# Altium schematic sheet USB.SchDoc
size A4
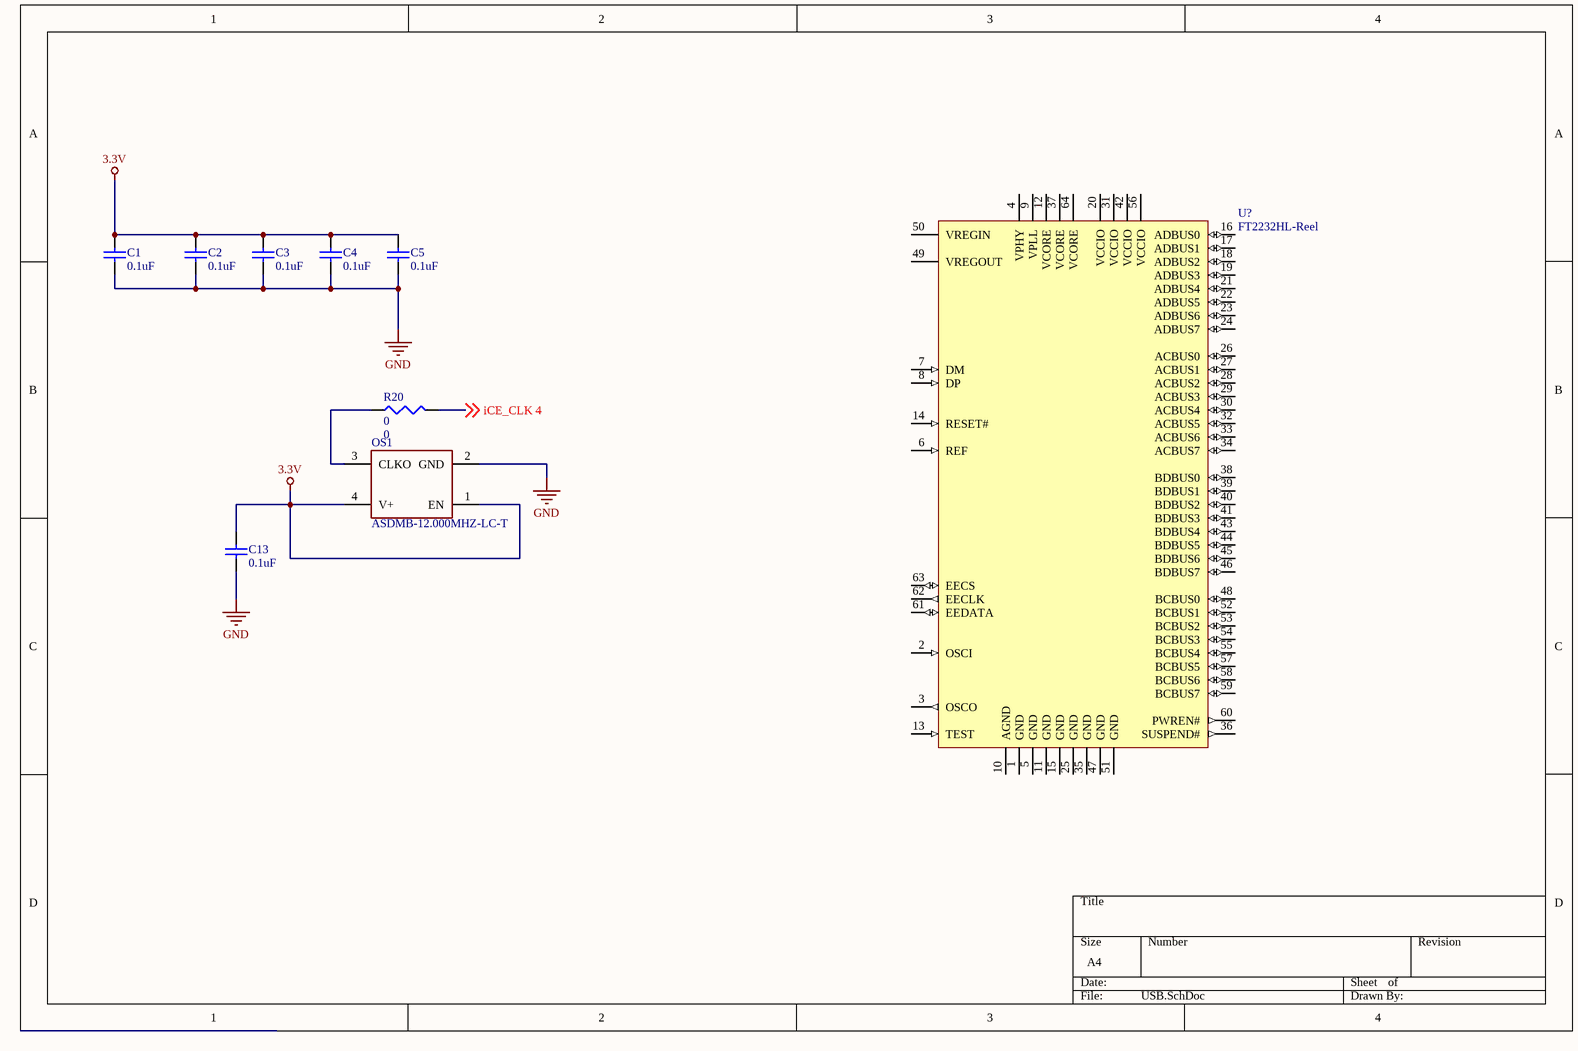
[diagram p0: USB.SchDoc]

## Parts
C1  0.1uF  [1608[0603]]
C2  0.1uF  [1608[0603]]
C3  0.1uF  [1608[0603]]
C4  0.1uF  [1608[0603]]
C5  0.1uF  [1608[0603]]
C13  0.1uF  [1608[0603]]
OS1  ASDMB-12.000MHZ-LC-T  [Q2520]
R20  0  [J1-0603]
U?  FT2232HL-Reel  [LQFP-64_N]

## Nets
3.3V: C1.2 C2.2 C3.2 C4.2 C5.2 C13.2 OS1.1(EN) OS1.4(V+)
GND: C1.1 C2.1 C3.1 C4.1 C5.1 C13.1 OS1.2(GND)
iCE_CLK 4: R20.2 ; off-sheet iCE_CLK 4
NetOS1_3: OS1.3(CLKO) R20.1

Not connected (* = marked no-connect by the designer): U? 1(GND) 2(OSCI) 3(OSCO) 4(VPHY) 5(GND) 6(REF) 7(DM) 8(DP) 9(VPLL) 10(AGND) 11(GND) 12(VCORE) 13(TEST) 14(RESET#) 15(GND) 16(ADBUS0) 17(ADBUS1) 18(ADBUS2) 19(ADBUS3) 20(VCCIO) 21(ADBUS4) 22(ADBUS5) 23(ADBUS6) 24(ADBUS7) 25(GND) 26(ACBUS0) 27(ACBUS1) 28(ACBUS2) 29(ACBUS3) 30(ACBUS4) 31(VCCIO) 32(ACBUS5) 33(ACBUS6) 34(ACBUS7) 35(GND) 36(SUSPEND#) 37(VCORE) 38(BDBUS0) 39(BDBUS1) 40(BDBUS2) 41(BDBUS3) 42(VCCIO) 43(BDBUS4) 44(BDBUS5) 45(BDBUS6) 46(BDBUS7) 47(GND) 48(BCBUS0) 49(VREGOUT) 50(VREGIN) 51(GND) 52(BCBUS1) 53(BCBUS2) 54(BCBUS3) 55(BCBUS4) 56(VCCIO) 57(BCBUS5) 58(BCBUS6) 59(BCBUS7) 60(PWREN#) 61(EEDATA) 62(EECLK) 63(EECS) 64(VCORE)

## Library data of the parts
C1-C5 C13 = Cap Semi: Capacitor (Semiconductor SIM Model); Published: 8-Jun-2000; LatestRevisionDate: 29-May-2009; LatestRevisionNote: IPC-7351 Footprint Added.; PackageReference: C1206; Publisher: Altium Limited; PackageDescription: Chip Capacitor; Value: 0.1uF
OS1 = OSC_12Mhz: 12Mhz Osc Module; MAN: Abracon Corporation; DIST PN: 535-11724-1-ND; DIST: Digikey; ICCO PN: MV181011; MAN PN: ASDMB-12.000MHZ-LC-T
R20 = Res3: Resistor; Published: 8-Jun-2000; LatestRevisionDate: 29-May-2009; LatestRevisionNote: IPC-7351 Footprint Added.; PackageReference: J1-0603; Publisher: Altium Limited; PackageDescription: Chip Resistor; Value: 0
U? = FT2232HL-Reel: Dual High Speed USB To Multipurpose UART/FIFO IC, 64-pin LQFP, Tape and Reel; Manufacturer: FTDI; DatasheetVersion: ver 2.21, Jun-2012; PackageVersion: Jun-12; PackageReference: LQFP-64; PackageDescription: 64-Pin Thin Quad Flat Pack, 10 x 10 x 1.4 mm Body, 0.5 mm Pitch; PartNumber: FT2232HL-Reel; ComponentLink1Description: Manufacturer URL; ComponentLink1URL: http://www.ftdichip.com/; ComponentLink2Description: Datasheet; ComponentLink2URL: http://www.ftdichip.com/Support/Documents/DataSheets/ICs/DS_FT2232H.pdf